# Altium schematic sheet STM32F103CxT_simple.SchDoc
size A4
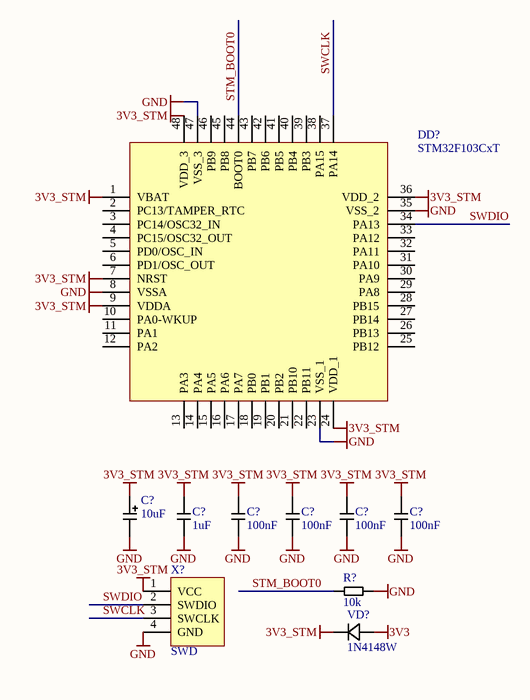
[diagram p0: STM32F103CxT_simple.SchDoc]

## Parts
(Parts that share a designator on the sheet are numbered #1, #2 ... from top to bottom, then left to right.)
C?#1  10uF  [SMD A]
C?#2  1uF  [C0603]
C?#3  100nF  [C0603]
C?#4  100nF  [C0603]
C?#5  100nF  [C0603]
C?#6  100nF  [C0603]
DD?  STM32F103CxT  [LQFP-48]
R?  10k  [R0603]
VD?  1N4148W  [SOD-123]
X?  SWD  [SWD-4]

## Nets
3V3: VD?.1(K)
3V3_STM: C?#1.1 C?#2.1 C?#3.1 C?#4.1 C?#5.1 C?#6.1 DD?.1(VBAT) DD?.7(NRST) DD?.9(VDDA) DD?.24(VDD_1) DD?.36(VDD_2) DD?.48(VDD_3) VD?.2(A) X?.1(VCC)
GND: C?#1.2 C?#2.2 C?#3.2 C?#4.2 C?#5.2 C?#6.2 DD?.8(VSSA) DD?.23(VSS_1) DD?.35(VSS_2) DD?.47(VSS_3) R?.1 X?.4(GND)
STM_BOOT0: DD?.44(BOOT0) R?.2
SWCLK: DD?.37(PA14) X?.3(SWCLK)
SWDIO: DD?.34(PA13) X?.2(SWDIO)

Not connected (* = marked no-connect by the designer): DD? 2(PC13/TAMPER_RTC) 3(PC14/OSC32_IN) 4(PC15/OSC32_OUT) 5(PD0/OSC_IN) 6(PD1/OSC_OUT) 10(PA0-WKUP) 11(PA1) 12(PA2) 13(PA3) 14(PA4) 15(PA5) 16(PA6) 17(PA7) 18(PB0) 19(PB1) 20(PB2) 21(PB10) 22(PB11) 25(PB12) 26(PB13) 27(PB14) 28(PB15) 29(PA8) 30(PA9) 31(PA10) 32(PA11) 33(PA12) 38(PA15) 39(PB3) 40(PB4) 41(PB5) 42(PB6) 43(PB7) 45(PB8) 46(PB9)

## Library data of the parts
C?#1 = CP: Capacitor polarized
C?#2-C?#6 = C: Capacitor
DD? = STM32F103CxT: ST MCU with USB
R? = R: Resistor
VD? = Diode: SMD diode
X? = SWD_4: SWD connector